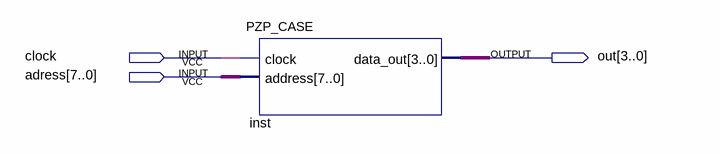
[diagram p0: schematic sheet]
// Quartus schematic Block1.bdf as structural Verilog: 1 symbols, 3 pins
module Block1 (
  input  clock,
  input  [7:0] adress,
  output [3:0] out
);

  PZP_CASE inst (.clock(clock), .address(adress), .data_out(out));
endmodule
